# Altium project RS232_ISOLATED.PrjPcb
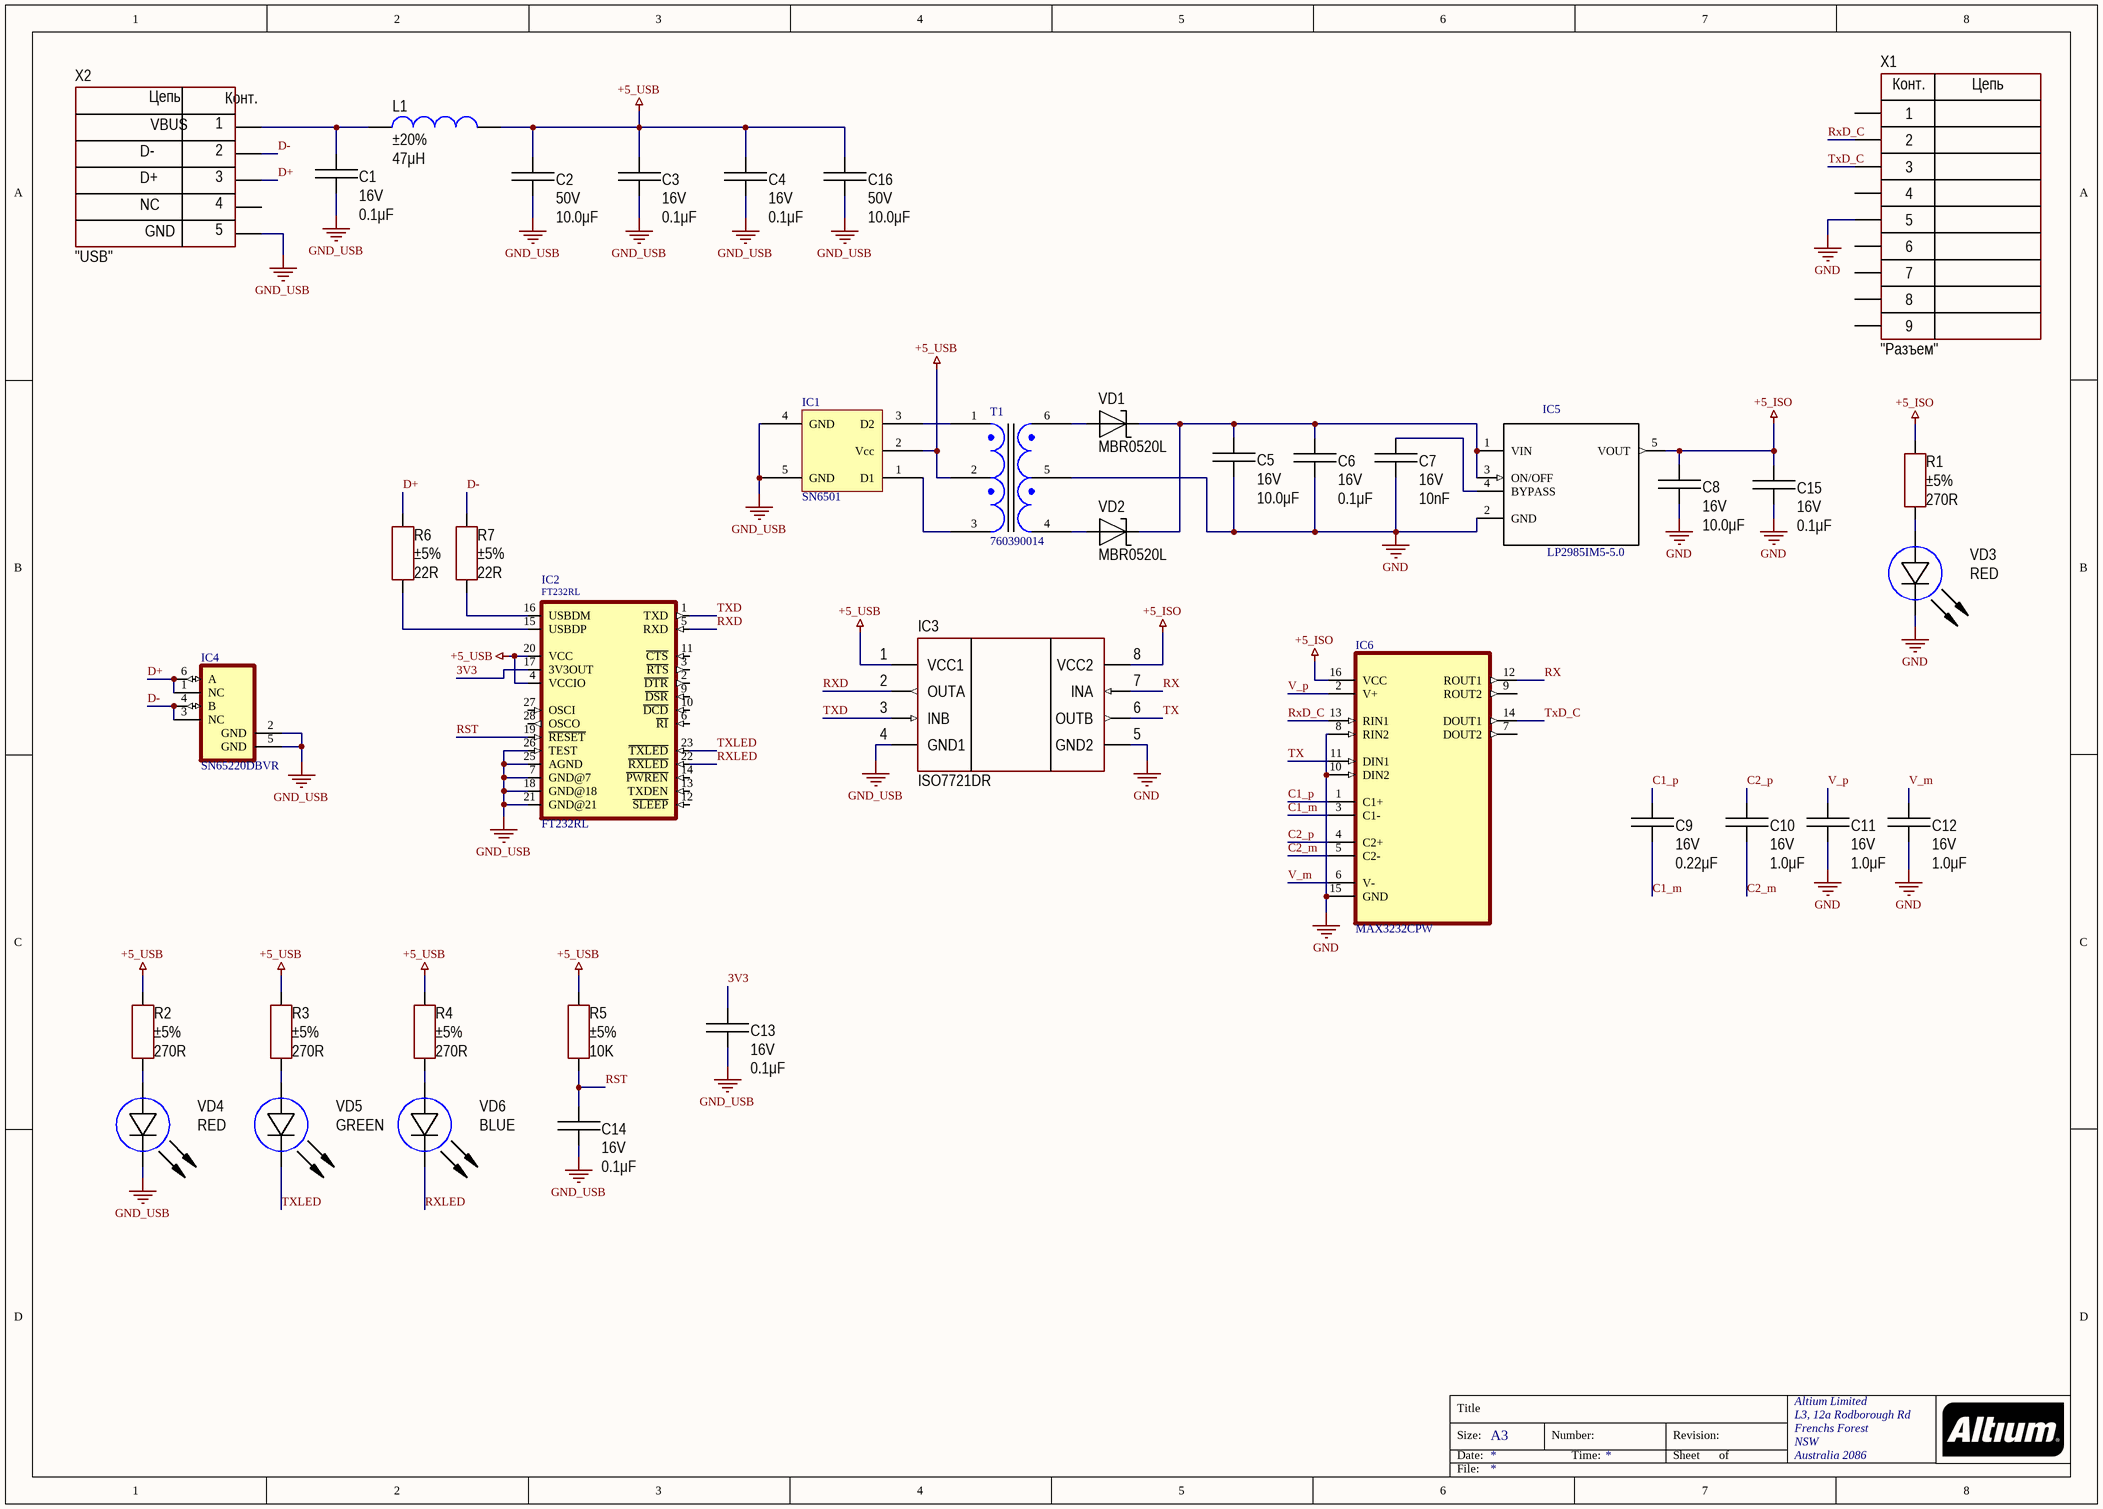
[diagram p0: RS232_ISOLATED.SchDoc]
1 sheet, 39 parts. Net scope: global (net labels, ports and power ports of the same name join across sheets).
Board file: PCB.PcbDoc

## Sheet RS232_ISOLATED.SchDoc
size A3; Organization: Altium Limited; Address1: L3, 12a Rodborough Rd; Address2: Frenchs Forest; Address3: NSW; Address4: Australia 2086

### Parts
C1  value 0.1μF  Voltage: 16V  [CAP: 0805]
C2  value 10.0μF  Voltage: 50V  [CAP: 1206]
C3  value 0.1μF  Voltage: 16V  [CAP: 0805]
C4  value 0.1μF  Voltage: 16V  [CAP: 0603]
C5  value 10.0μF  Voltage: 16V  [CAP: 0805]
C6  value 0.1μF  Voltage: 16V  [CAP: 0805]
C7  value 10nF  Voltage: 16V  [CAP: 0603]
C8  value 10.0μF  Voltage: 16V  [CAP: 0805]
C9  value 0.22μF  Voltage: 16V  [CAP: 0603]
C10  value 1.0μF  Voltage: 16V  [CAP: 0603]
C11  value 1.0μF  Voltage: 16V  [CAP: 0603]
C12  value 1.0μF  Voltage: 16V  [CAP: 0603]
C13  value 0.1μF  Voltage: 16V  [CAP: 0603]
C14  value 0.1μF  Voltage: 16V  [CAP: 0603]
C15  value 0.1μF  Voltage: 16V  [CAP: 0805]
C16  value 10.0μF  Voltage: 50V  [CAP: 1206]
IC1  SN6501  [SOT23-5]
IC2  FT232RL  [28-SSOP]
IC3  (no value)  [8-SOIC]
IC4  SN65220DBVR  [SOT23-6]
IC5  LP2985IM5-5.0  [SOT23-5]
IC6  MAX3232CPW  [SOP65P640X120-16N]
L1  value 47μH  Tolerance: ±20%  [IND: 0805]
R1  value 270R  Tolerance: ±5%  [RES: 0603]
R2  value 270R  Tolerance: ±5%  [RES: 0603]
R3  value 270R  Tolerance: ±5%  [RES: 0603]
R4  value 270R  Tolerance: ±5%  [RES: 0603]
R5  value 10K  Tolerance: ±5%  [RES: 0603]
R6  value 22R  Tolerance: ±5%  [RES: 0603]
R7  value 22R  Tolerance: ±5%  [RES: 0603]
T1  760390014  [PCBComponent_1]
VD1  PartNumber: MBR0520L  [DIODE: SOD123]
VD2  PartNumber: MBR0520L  [DIODE: SOD123]
VD3  Color: RED  [LED: 0402B]
VD4  Color: RED  [LED: 0402B]
VD5  Color: GREEN  [LED: 0402B]
VD6  Color: BLUE  [LED: 0402B]
X1  CommentText: "Разъем"  [CON: DB-9M]
X2  CommentText: "USB"  [CON: 0675031020]

### Nets
+5_ISO: C8.2 C15.2 IC3.8(VCC2) IC5.5(VOUT) IC6.16(VCC) R1.2
+5_USB: C2.2 C3.2 C4.2 C16.2 IC1.2(Vcc) IC2.4(VCCIO) IC2.20(VCC) IC3.1(VCC1) L1.1 R2.2 R3.2 R4.2 R5.2 T1.2
GND: C5.1 C6.1 C7.1 C8.1 C11.1 C12.1 C15.1 IC3.5(GND2) IC5.2(GND) IC6.8(RIN2) IC6.10(DIN2) IC6.15(GND) T1.5 VD3.2(C) X1.5
GND_USB: C1.1 C2.1 C3.1 C4.1 C13.1 C14.1 C16.1 IC1.4(GND) IC1.5(GND) IC2.7(GND@7) IC2.18(GND@18) IC2.21(GND@21) IC2.25(AGND) IC2.26(TEST) IC3.4(GND1) IC4.2(GND) IC4.5(GND) VD4.2(C) X2.5
3V3: C13.2 IC2.17(3V3OUT)
C1_m: C9.1 IC6.3(C1-)
C1_p: C9.2 IC6.1(C1+)
C2_m: C10.1 IC6.5(C2-)
C2_p: C10.2 IC6.4(C2+)
D+: IC4.1(NC) IC4.6(A) R6.2 X2.3
D-: IC4.3(NC) IC4.4(B) R7.2 X2.2
RST: C14.2 IC2.19(~{RESET}) R5.1
RX: IC3.7(INA) IC6.12(ROUT1)
RXD: IC2.5(RXD) IC3.2(OUTA)
RxD_C: IC6.13(RIN1) X1.2
RXLED: IC2.22(~{RXLED}) VD6.2(C)
TX: IC3.6(OUTB) IC6.11(DIN1)
TXD: IC2.1(TXD) IC3.3(INB)
TxD_C: IC6.14(DOUT1) X1.3
TXLED: IC2.23(~{TXLED}) VD5.2(C)
V_m: C12.2 IC6.6(V-)
V_p: C11.2 IC6.2(V+)
NetC1_2: C1.2 L1.2 X2.1
NetC5_2: C5.2 C6.2 IC5.1(VIN) IC5.3(ON/OFF) VD1.2 VD2.2
NetC7_2: C7.2 IC5.4(BYPASS)
NetIC1_1: IC1.1(D1) T1.3
NetIC1_3: IC1.3(D2) T1.1
NetIC2_15: IC2.15(USBDP) R6.1
NetIC2_16: IC2.16(USBDM) R7.1
NetR1_1: R1.1 VD3.1(A)
NetR2_1: R2.1 VD4.1(A)
NetR3_1: R3.1 VD5.1(A)
NetR4_1: R4.1 VD6.1(A)
NetT1_4: T1.4 VD2.1
NetT1_6: T1.6 VD1.1

Not connected (* = marked no-connect by the designer): IC2 2(~{DTR}) 3(~{RTS}) 6(~{RI}) 9(~{DSR}) 10(~{DCD}) 11(~{CTS}) 12(~{SLEEP}) 13(TXDEN) 14(~{PWREN}) 27(OSCI) 28(OSCO); IC6 7(DOUT2) 9(ROUT2); X1 1 4 6 7 8 9; X2 4

### Notes on the sheet
- Title
- Size:
- Date:
- A3
- Number:
- Time:
- Revision:
- Sheet
- of
- File:
- (in symbol Connector_DB9F) Конт.; Цепь
- (in symbol Connector_USB_mini_B) Цепь; Конт.; VBUS; D-; D+; NC; GND

### Library data of the parts
C1 C3 C4 C6 C15 = Ceramic_0805: Manufacturer: Yageo; PartNumber: CC0805KRX7R7BB104; ValueManufacturerPartNumber: Ceramic capacitor, 0.1μF, X7R, ±10%, 16V, 0805, -55...+125°C; TypeCapacitor: Ceramic capacitor; Tolerance: ±10%; TypeDielectric: X7R; Package: 0805; HelpURL: https://www.digikey.com/product-detail/en/yageo/CC0805KRX7R7BB104/311-1142-1-ND/303052; Temperature: -55...+125°C
C2 C16 = Ceramic_1206: Manufacturer: Yageo; PartNumber: CC1206KRX7R9BB104; ValueManufacturerPartNumber: Ceramic capacitor, 10.0μF, X7R, ±10%, 50V, 1206, -55...+125°C; TypeCapacitor: Ceramic capacitor; Tolerance: ±10%; TypeDielectric: X7R; Package: 1206; HelpURL: https://www.digikey.com/product-detail/en/yageo/CC1206KRX7R9BB104/311-1179-1-ND/303089; Temperature: -55...+125°C
C5 C8 = Ceramic_0805: Manufacturer: Yageo; PartNumber: CC0805KRX7R7BB104; ValueManufacturerPartNumber: Ceramic capacitor, 10.0μF, X7R, ±10%, 16V, 0805, -55...+125°C; TypeCapacitor: Ceramic capacitor; Tolerance: ±10%; TypeDielectric: X7R; Package: 0805; HelpURL: https://www.digikey.com/product-detail/en/yageo/CC0805KRX7R7BB104/311-1142-1-ND/303052; Temperature: -55...+125°C
C7 = Ceramic_0603: Manufacturer: Yageo; PartNumber: CC0603KRX7R7BB104; ValueManufacturerPartNumber: Ceramic capacitor, 10nF, X7R, ±10%, 16V, 0603, -55...+125°C; TypeCapacitor: Ceramic capacitor; Tolerance: ±10%; TypeDielectric: X7R; Package: 0603; HelpURL: https://www.digikey.com/product-detail/en/yageo/CC0603KRX7R7BB104/311-1088-1-ND/302998; Temperature: -55...+125°C
C9 = Ceramic_0603: Manufacturer: Yageo; PartNumber: CC0603KRX7R7BB104; ValueManufacturerPartNumber: Ceramic capacitor, 0.22μF, X7R, ±10%, 16V, 0603, -55...+125°C; TypeCapacitor: Ceramic capacitor; Tolerance: ±10%; TypeDielectric: X7R; Package: 0603; HelpURL: https://www.digikey.com/product-detail/en/yageo/CC0603KRX7R7BB104/311-1088-1-ND/302998; Temperature: -55...+125°C
C10-C12 = Ceramic_0603: Manufacturer: Yageo; PartNumber: CC0603KRX7R7BB104; ValueManufacturerPartNumber: Ceramic capacitor, 1.0μF, X7R, ±10%, 16V, 0603, -55...+125°C; TypeCapacitor: Ceramic capacitor; Tolerance: ±10%; TypeDielectric: X7R; Package: 0603; HelpURL: https://www.digikey.com/product-detail/en/yageo/CC0603KRX7R7BB104/311-1088-1-ND/302998; Temperature: -55...+125°C
C13 C14 = Ceramic_0603: Manufacturer: Yageo; PartNumber: CC0603KRX7R7BB104; ValueManufacturerPartNumber: Ceramic capacitor, 0.1μF, X7R, ±10%, 16V, 0603, -55...+125°C; TypeCapacitor: Ceramic capacitor; Tolerance: ±10%; TypeDielectric: X7R; Package: 0603; HelpURL: https://www.digikey.com/product-detail/en/yageo/CC0603KRX7R7BB104/311-1088-1-ND/302998; Temperature: -55...+125°C
IC2 = FT232RL: USB ë¸Œë¦¬ì§€, USB-UART USB 2.0 UART ì¸í„°íŽ˜ì´ìŠ¤ 28-SSOP; MF: FTDI, Future; Package: SSOP-28 FTDI, Future; Price: None; Availability: Unavailable; MP: FT232RL; SnapEDA_Link: https://www.snapeda.com/parts/FT232RL/FTDI%2C%20Future%20Technology%20Devices%20International%20Ltd/view-part/1077088/?ref=snap; Value: *
IC3 = ISO7721DR: Digital isolator; Manufacturer: Texas Instruments; ValueManufacturerPartNumber: IC digital isolator, 100Mbps, 3000Vrms, 2.25...5.5V, -55...+125°C, 8-SOIC; Supply: 2.25...5.5V; DataRate: 100Mbps; Isolation: 3000Vrms; HelpURL: https://www.digikey.com/product-detail/en/texas-instruments/ISO7721DR/296-48296-1-ND/8347715; Package: 8-SOIC; ComponentType: IC digital isolator; Temperature: -55...+125°C; PartNumber: ISO7721DR
IC4 = SN65220DBVR: IC SINGLE USB PORT TVS SOT-23-6; MF: Texas Instruments; Price: None; Value: *; MP: SN65220DBVR; Package: SOT-23-6 Texas Instruments; SnapEDA_Link: https://www.snapeda.com/parts/SN65220DBVR/Texas%20Instruments/view-part/214591/?ref=snap; Availability: Unavailable
IC6 = MAX3232CPW: 2/2 Transceiver Full RS232 16-TSSOP; MF: Texas Instruments; MP: MAX3232CPW; Availability: Unavailable; SnapEDA_Link: https://www.snapeda.com/parts/MAX3232CPW/Texas%20Instruments/view-part/396297/?ref=snap; Package: TSSOP-16 Texas Instruments; Price: None; Value: *
L1 = Inductor_0805: Manufacturer: Murata Electronics; PartNumber: LQM21FN100M70L; ValueManufacturerPartNumber: Fixed inductor, 47μH, ±20%, 0805, 100mA, -55...+125°C; TypeInductor: Fixed inductor; MaxCurrent: 100mA; Package: 0805; HelpURL: https://www.digikey.com/product-detail/en/murata-electronics-north-america/LQM21FN100M70L/490-4029-1-ND/1016289; Temperature: -55...+125°C
R1-R4 = Resistor_0603: Manufacturer: Yageo; PartNumber: RC0603JR-07100RL; ValueManufacturerPartNumber: Resistor film, 270R, ±5%, 0603, 0.1W, -55...+125°C; TypeResistor: Resistor film; Power: 0.1W; Package: 0603; HelpURL: https://www.digikey.com/product-detail/en/yageo/RC0603JR-07100RL/311-100GRCT-ND/729644; Temperature: -55...+125°C
R5 = Resistor_0603: Manufacturer: Yageo; PartNumber: RC0603JR-07100RL; ValueManufacturerPartNumber: Resistor film, 10K, ±5%, 0603, 0.1W, -55...+125°C; TypeResistor: Resistor film; Power: 0.1W; Package: 0603; HelpURL: https://www.digikey.com/product-detail/en/yageo/RC0603JR-07100RL/311-100GRCT-ND/729644; Temperature: -55...+125°C
R6 R7 = Resistor_0603: Manufacturer: Yageo; PartNumber: RC0603JR-07100RL; ValueManufacturerPartNumber: Resistor film, 22R, ±5%, 0603, 0.1W, -55...+125°C; TypeResistor: Resistor film; Power: 0.1W; Package: 0603; HelpURL: https://www.digikey.com/product-detail/en/yageo/RC0603JR-07100RL/311-100GRCT-ND/729644; Temperature: -55...+125°C
VD1 VD2 = Schottky_single: Manufacturer: Diodes Incorporated; ValueManufacturerPartNumber: Schottky diode, 80V, 500mA, 1V, 15pF, SOD-123, -55...+150°C; TypeDiode: Schottky diode; Voltage: 80V; Current: 500mA; VoltageDrop: 1V; RecoveryTime: 15pF; Package: SOD-123; HelpURL: https://www.digikey.com/product-detail/en/diodes-incorporated/MBR0580S1-7/MBR0580S1-7DICT-ND/5080371; Temperature: -55...+150°C
VD3-VD6 = LED_single: ValueManufacturerPartNumber: LED, *, *, *, -55...+150°C; TypeDiode: LED; Manufacturer: *; Package: *; HelpURL: *; Temperature: -55...+150°C; Current: *; VoltageDrop: *; PartNumber: *
X1 = Connector_DB9F: Manufacturer: Connfly; ValueManufacturerPartNumber: Connector, 10pin, 2.54mm, 500VAC, 3A; PartNumber: PBD-10; VoltageMax: 500VAC; Pitch: 2.54mm; CurrentMax: 3A; Multichannel: 10pin; HelpURL: https://www.chipdip.ru/product/pbd-10; TypeConnector: Connector
X2 = Connector_USB_mini_B: Manufacturer: Molex; ValueManufacturerPartNumber: USB mini B; PartNumber: 0675031020; HelpURL: https://www.digikey.com/product-detail/en/molex/0675031020/WM5461CT-ND/1624427; TypeConnector: USB mini B
IC5 = LP2985IM5-5.0: SnapEDA_Link: https://www.snapeda.com/parts/LP2985IM550/Texas%20Instruments/view-part/29473/?ref=snap; Value: *